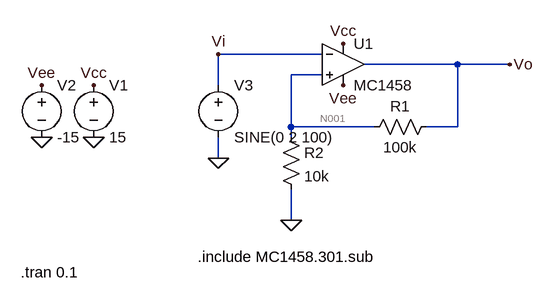
[diagram p0: schematic kadai1-5.asc]
kadai1-5.asc, the LTspice schematic file:
Version 4
SHEET 1 880 680
WIRE 448 96 288 96
WIRE 656 112 512 112
WIRE 736 112 656 112
WIRE 448 128 400 128
WIRE 288 144 288 96
WIRE 400 208 400 128
WIRE 528 208 400 208
WIRE 656 208 656 112
WIRE 656 208 608 208
WIRE 400 224 400 208
WIRE 288 256 288 224
WIRE 400 352 400 304
FLAG 96 224 0
FLAG 16 224 0
FLAG 96 144 Vcc
FLAG 16 144 Vee
FLAG 288 256 0
FLAG 400 352 0
FLAG 480 80 Vcc
FLAG 480 144 Vee
FLAG 736 112 Vo
FLAG 288 96 Vi
SYMBOL voltage 96 128 R0
WINDOW 123 0 0 Left 0
WINDOW 39 0 0 Left 0
SYMATTR InstName V1
SYMATTR Value 15
SYMBOL voltage 16 128 R0
SYMATTR InstName V2
SYMATTR Value -15
SYMBOL voltage 288 128 R0
WINDOW 123 0 0 Left 0
WINDOW 39 0 0 Left 0
SYMATTR InstName V3
SYMATTR Value SINE(0 2 100)
SYMBOL OpAmps\\opamp2 480 48 R0
SYMATTR InstName U1
SYMATTR Value MC1458
SYMBOL res 624 192 R90
WINDOW 0 0 56 VBottom 2
WINDOW 3 32 56 VTop 2
SYMATTR InstName R1
SYMATTR Value 100k
SYMBOL res 384 208 R0
SYMATTR InstName R2
SYMATTR Value 10k
TEXT 256 408 Left 2 !.include MC1458.301.sub
TEXT -16 432 Left 2 !.tran 0.1

The netlist it stands for:
* kadai1-5.asc
V1 Vcc 0 15
V2 Vee 0 -15
V3 Vi 0 SINE(0 2 100)
XU1 N001 Vi Vcc Vee Vo MC1458  ; pins In+ In- V+ V- OUT
R1 Vo N001 100k
R2 N001 0 10k
.include MC1458.301.sub
.tran 0.1
.backanno
.end

* Results of the author's LTspice run, read from the files saved beside the schematic
* Operating Point, zero values left out:
*   V(vcc) = 15 V
*   V(vee) = -15 V
*   V(vo) = 7.851 mV
*   V(n001) = -11.15 µV
*   I(R1) = 78.62 nA
*   I(R2) = -1.115 nA
*   I(V1) = -1.667 mA
*   I(V2) = 1.667 mA
*   I(V3) = -79.76 nA
*   Ix(u1:1) = 79.74 nA
*   Ix(u1:2) = 79.76 nA
*   Ix(u1:3) = 1.667 mA
*   Ix(u1:4) = -1.667 mA
*   Ix(u1:5) = -78.62 nA